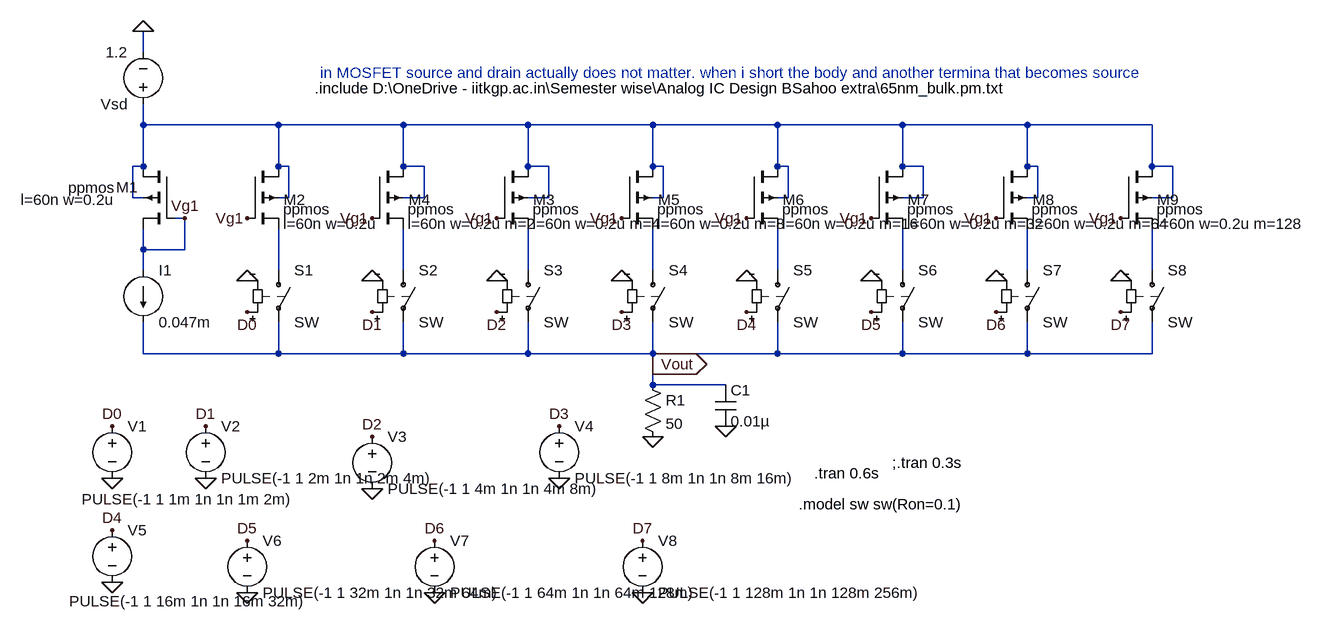
[diagram p0: schematic short_channel.asc]
short_channel.asc, the LTspice schematic file:
Version 4
SHEET 1 1040 1000
WIRE -688 128 -688 96
WIRE -688 240 -688 208
WIRE -480 240 -688 240
WIRE -288 240 -480 240
WIRE -96 240 -288 240
WIRE 96 240 -96 240
WIRE 288 240 96 240
WIRE 480 240 288 240
WIRE 672 240 480 240
WIRE 864 240 672 240
WIRE -688 304 -688 240
WIRE -688 304 -704 304
WIRE -480 304 -480 240
WIRE -464 304 -480 304
WIRE -288 304 -288 240
WIRE -256 304 -288 304
WIRE -96 304 -96 240
WIRE -64 304 -96 304
WIRE 96 304 96 240
WIRE 112 304 96 304
WIRE 288 304 288 240
WIRE 304 304 288 304
WIRE 480 304 480 240
WIRE 512 304 480 304
WIRE 672 304 672 240
WIRE 688 304 672 304
WIRE 864 304 864 240
WIRE 896 304 864 304
WIRE -704 352 -704 304
WIRE -688 352 -704 352
WIRE -464 352 -464 304
WIRE -464 352 -480 352
WIRE -256 352 -256 304
WIRE -256 352 -288 352
WIRE -64 352 -64 304
WIRE -64 352 -96 352
WIRE 112 352 112 304
WIRE 112 352 96 352
WIRE 304 352 304 304
WIRE 304 352 288 352
WIRE 512 352 512 304
WIRE 512 352 480 352
WIRE 688 352 688 304
WIRE 688 352 672 352
WIRE 896 352 896 304
WIRE 896 352 864 352
WIRE -624 384 -640 384
WIRE -688 432 -688 400
WIRE -624 432 -624 384
WIRE -624 432 -688 432
WIRE -688 464 -688 432
WIRE -480 464 -480 400
WIRE -288 464 -288 400
WIRE -96 464 -96 400
WIRE 96 464 96 400
WIRE 288 464 288 400
WIRE 480 464 480 400
WIRE 672 464 672 400
WIRE 864 464 864 400
WIRE -688 592 -688 544
WIRE -480 592 -480 544
WIRE -480 592 -688 592
WIRE -288 592 -288 544
WIRE -288 592 -480 592
WIRE -96 592 -96 544
WIRE -96 592 -288 592
WIRE 96 592 96 544
WIRE 96 592 -96 592
WIRE 288 592 288 544
WIRE 288 592 96 592
WIRE 480 592 480 544
WIRE 480 592 288 592
WIRE 672 592 672 544
WIRE 672 592 480 592
WIRE 864 592 864 544
WIRE 864 592 672 592
WIRE 96 608 96 592
WIRE 96 640 96 608
WIRE 208 640 96 640
FLAG -688 96 0
FLAG -624 384 Vg1
FLAG -528 384 Vg1
FLAG 96 720 0
FLAG 96 608 Vout
IOPIN 96 608 Out
FLAG -336 384 Vg1
FLAG -144 384 Vg1
FLAG 48 384 Vg1
FLAG 240 384 Vg1
FLAG 432 384 Vg1
FLAG 624 384 Vg1
FLAG 816 384 Vg1
FLAG -528 528 D0
FLAG -336 528 D1
FLAG -144 528 D2
FLAG 48 528 D3
FLAG 240 528 D4
FLAG 432 528 D5
FLAG 624 528 D6
FLAG 816 528 D7
FLAG -528 480 0
FLAG -336 480 0
FLAG -144 480 0
FLAG 48 480 0
FLAG 240 480 0
FLAG 432 480 0
FLAG 624 480 0
FLAG 816 480 0
FLAG -736 784 0
FLAG -592 784 0
FLAG -336 800 0
FLAG -48 784 0
FLAG -240 960 0
FLAG -528 960 0
FLAG -736 944 0
FLAG -736 704 D0
FLAG -592 704 D1
FLAG -336 720 D2
FLAG -48 704 D3
FLAG -736 864 D4
FLAG -528 880 D5
FLAG -240 880 D6
FLAG 80 880 D7
FLAG 80 960 0
FLAG 208 704 0
SYMBOL voltage -688 224 R180
WINDOW 123 0 0 Left 0
WINDOW 39 0 0 Left 0
SYMATTR InstName Vsd
SYMATTR Value 1.2
SYMBOL pmos4 -528 304 R0
WINDOW 3 55 66 Left 2
WINDOW 123 55 88 Left 2
WINDOW 0 56 51 Left 2
SYMATTR Value ppmos
SYMATTR Value2 l=60n w=0.2u
SYMATTR InstName M2
SYMBOL pmos4 -640 304 M0
WINDOW 3 91 33 Left 2
WINDOW 123 91 51 Left 2
SYMATTR Value ppmos
SYMATTR Value2 l=60n w=0.2u
SYMATTR InstName M1
SYMBOL current -688 464 R0
WINDOW 123 0 0 Left 0
WINDOW 39 0 0 Left 0
SYMATTR InstName I1
SYMATTR Value 0.047m
SYMBOL res 80 624 R0
SYMATTR InstName R1
SYMATTR Value 50
SYMBOL sw -480 448 R0
SYMATTR InstName S1
SYMBOL sw -288 448 R0
SYMATTR InstName S2
SYMBOL pmos4 -336 304 R0
WINDOW 3 55 66 Left 2
WINDOW 123 55 88 Left 2
WINDOW 0 56 51 Left 2
SYMATTR Value ppmos
SYMATTR Value2 l=60n w=0.2u m=2
SYMATTR InstName M4
SYMBOL pmos4 -144 304 R0
WINDOW 3 55 66 Left 2
WINDOW 123 55 88 Left 2
WINDOW 0 56 51 Left 2
SYMATTR Value ppmos
SYMATTR Value2 l=60n w=0.2u m=4
SYMATTR InstName M3
SYMBOL pmos4 48 304 R0
WINDOW 3 55 66 Left 2
WINDOW 123 55 88 Left 2
WINDOW 0 56 51 Left 2
SYMATTR Value ppmos
SYMATTR Value2 l=60n w=0.2u m=8
SYMATTR InstName M5
SYMBOL pmos4 240 304 R0
WINDOW 3 55 66 Left 2
WINDOW 123 55 88 Left 2
WINDOW 0 56 51 Left 2
SYMATTR Value ppmos
SYMATTR Value2 l=60n w=0.2u m=16
SYMATTR InstName M6
SYMBOL pmos4 432 304 R0
WINDOW 3 55 66 Left 2
WINDOW 123 55 88 Left 2
WINDOW 0 56 51 Left 2
SYMATTR Value ppmos
SYMATTR Value2 l=60n w=0.2u m=32
SYMATTR InstName M7
SYMBOL pmos4 624 304 R0
WINDOW 3 55 66 Left 2
WINDOW 123 55 88 Left 2
WINDOW 0 56 51 Left 2
SYMATTR Value ppmos
SYMATTR Value2 l=60n w=0.2u m=64
SYMATTR InstName M8
SYMBOL pmos4 816 304 R0
WINDOW 3 55 66 Left 2
WINDOW 123 55 88 Left 2
WINDOW 0 56 51 Left 2
SYMATTR Value ppmos
SYMATTR Value2 l=60n w=0.2u m=128
SYMATTR InstName M9
SYMBOL sw -96 448 R0
SYMATTR InstName S3
SYMBOL sw 96 448 R0
SYMATTR InstName S4
SYMBOL sw 288 448 R0
SYMATTR InstName S5
SYMBOL sw 480 448 R0
SYMATTR InstName S6
SYMBOL sw 672 448 R0
SYMATTR InstName S7
SYMBOL sw 864 448 R0
SYMATTR InstName S8
SYMBOL voltage -736 688 R0
WINDOW 3 -47 128 Left 2
WINDOW 123 0 0 Left 0
WINDOW 39 0 0 Left 0
SYMATTR Value PULSE(-1 1 1m 1n 1n 1m 2m)
SYMATTR InstName V1
SYMBOL voltage -592 688 R0
SYMATTR InstName V2
SYMATTR Value PULSE(-1 1 2m 1n 1n 2m 4m)
SYMBOL voltage -336 704 R0
SYMATTR InstName V3
SYMATTR Value PULSE(-1 1 4m 1n 1n 4m 8m)
SYMBOL voltage -48 688 R0
SYMATTR InstName V4
SYMATTR Value PULSE(-1 1 8m 1n 1n 8m 16m)
SYMBOL voltage -736 848 R0
WINDOW 3 -66 125 Left 2
SYMATTR Value PULSE(-1 1 16m 1n 1n 16m 32m)
SYMATTR InstName V5
SYMBOL voltage -528 864 R0
SYMATTR InstName V6
SYMATTR Value PULSE(-1 1 32m 1n 1n 32m 64m)
SYMBOL voltage -240 864 R0
SYMATTR InstName V7
SYMATTR Value PULSE(-1 1 64m 1n 1n 64m 128m)
SYMBOL voltage 80 864 R0
SYMATTR InstName V8
SYMATTR Value PULSE(-1 1 128m 1n 1n 128m 256m)
SYMBOL cap 192 640 R0
SYMATTR InstName C1
SYMATTR Value 0.01µ
TEXT -424 184 Left 2 !.include D:\\OneDrive - iitkgp.ac.in\\Semester wise\\Analog IC Design BSahoo extra\\65nm_bulk.pm.txt
TEXT -416 160 Left 2 ;in MOSFET source and drain actually does not matter. when i short the body and another termina that becomes source
TEXT 320 824 Left 2 !.model sw sw(Ron=0.1)
TEXT 344 776 Left 2 !.tran 0.6s
TEXT 464 760 Left 2 !;.tran 0.3s

The netlist it stands for:
* short_channel.asc
Vsd N001 0 1.2
M2 N001 Vg1 N002 N001 ppmos l=60n w=0.2u
M1 N001 Vg1 Vg1 N001 ppmos l=60n w=0.2u
I1 Vg1 Vout 0.047m
R1 Vout 0 50
S1 N002 Vout D0 0 SW
S2 N003 Vout D1 0 SW
M4 N001 Vg1 N003 N001 ppmos l=60n w=0.2u m=2
M3 N001 Vg1 N004 N001 ppmos l=60n w=0.2u m=4
M5 N001 Vg1 N005 N001 ppmos l=60n w=0.2u m=8
M6 N001 Vg1 N006 N001 ppmos l=60n w=0.2u m=16
M7 N001 Vg1 N007 N001 ppmos l=60n w=0.2u m=32
M8 N001 Vg1 N008 N001 ppmos l=60n w=0.2u m=64
M9 N001 Vg1 N009 N001 ppmos l=60n w=0.2u m=128
S3 N004 Vout D2 0 SW
S4 N005 Vout D3 0 SW
S5 N006 Vout D4 0 SW
S6 N007 Vout D5 0 SW
S7 N008 Vout D6 0 SW
S8 N009 Vout D7 0 SW
V1 D0 0 PULSE(-1 1 1m 1n 1n 1m 2m)
V2 D1 0 PULSE(-1 1 2m 1n 1n 2m 4m)
V3 D2 0 PULSE(-1 1 4m 1n 1n 4m 8m)
V4 D3 0 PULSE(-1 1 8m 1n 1n 8m 16m)
V5 D4 0 PULSE(-1 1 16m 1n 1n 16m 32m)
V6 D5 0 PULSE(-1 1 32m 1n 1n 32m 64m)
V7 D6 0 PULSE(-1 1 64m 1n 1n 64m 128m)
V8 D7 0 PULSE(-1 1 128m 1n 1n 128m 256m)
C1 Vout 0 0.01µ
.model NMOS NMOS
.model PMOS PMOS
.lib standard.mos
.include D:\OneDrive - iitkgp.ac.in\Semester wise\Analog IC Design BSahoo extra\65nm_bulk.pm.txt
* in MOSFET source and drain actually does not matter. when i short the body and another termina that becomes source
.model sw sw(Ron=0.1)
.tran 0.6s
;.tran 0.3s
.backanno
.end